# Altium project Pixracer_V1_FMU_Alternative.PrjPcb (part 2 of 2)
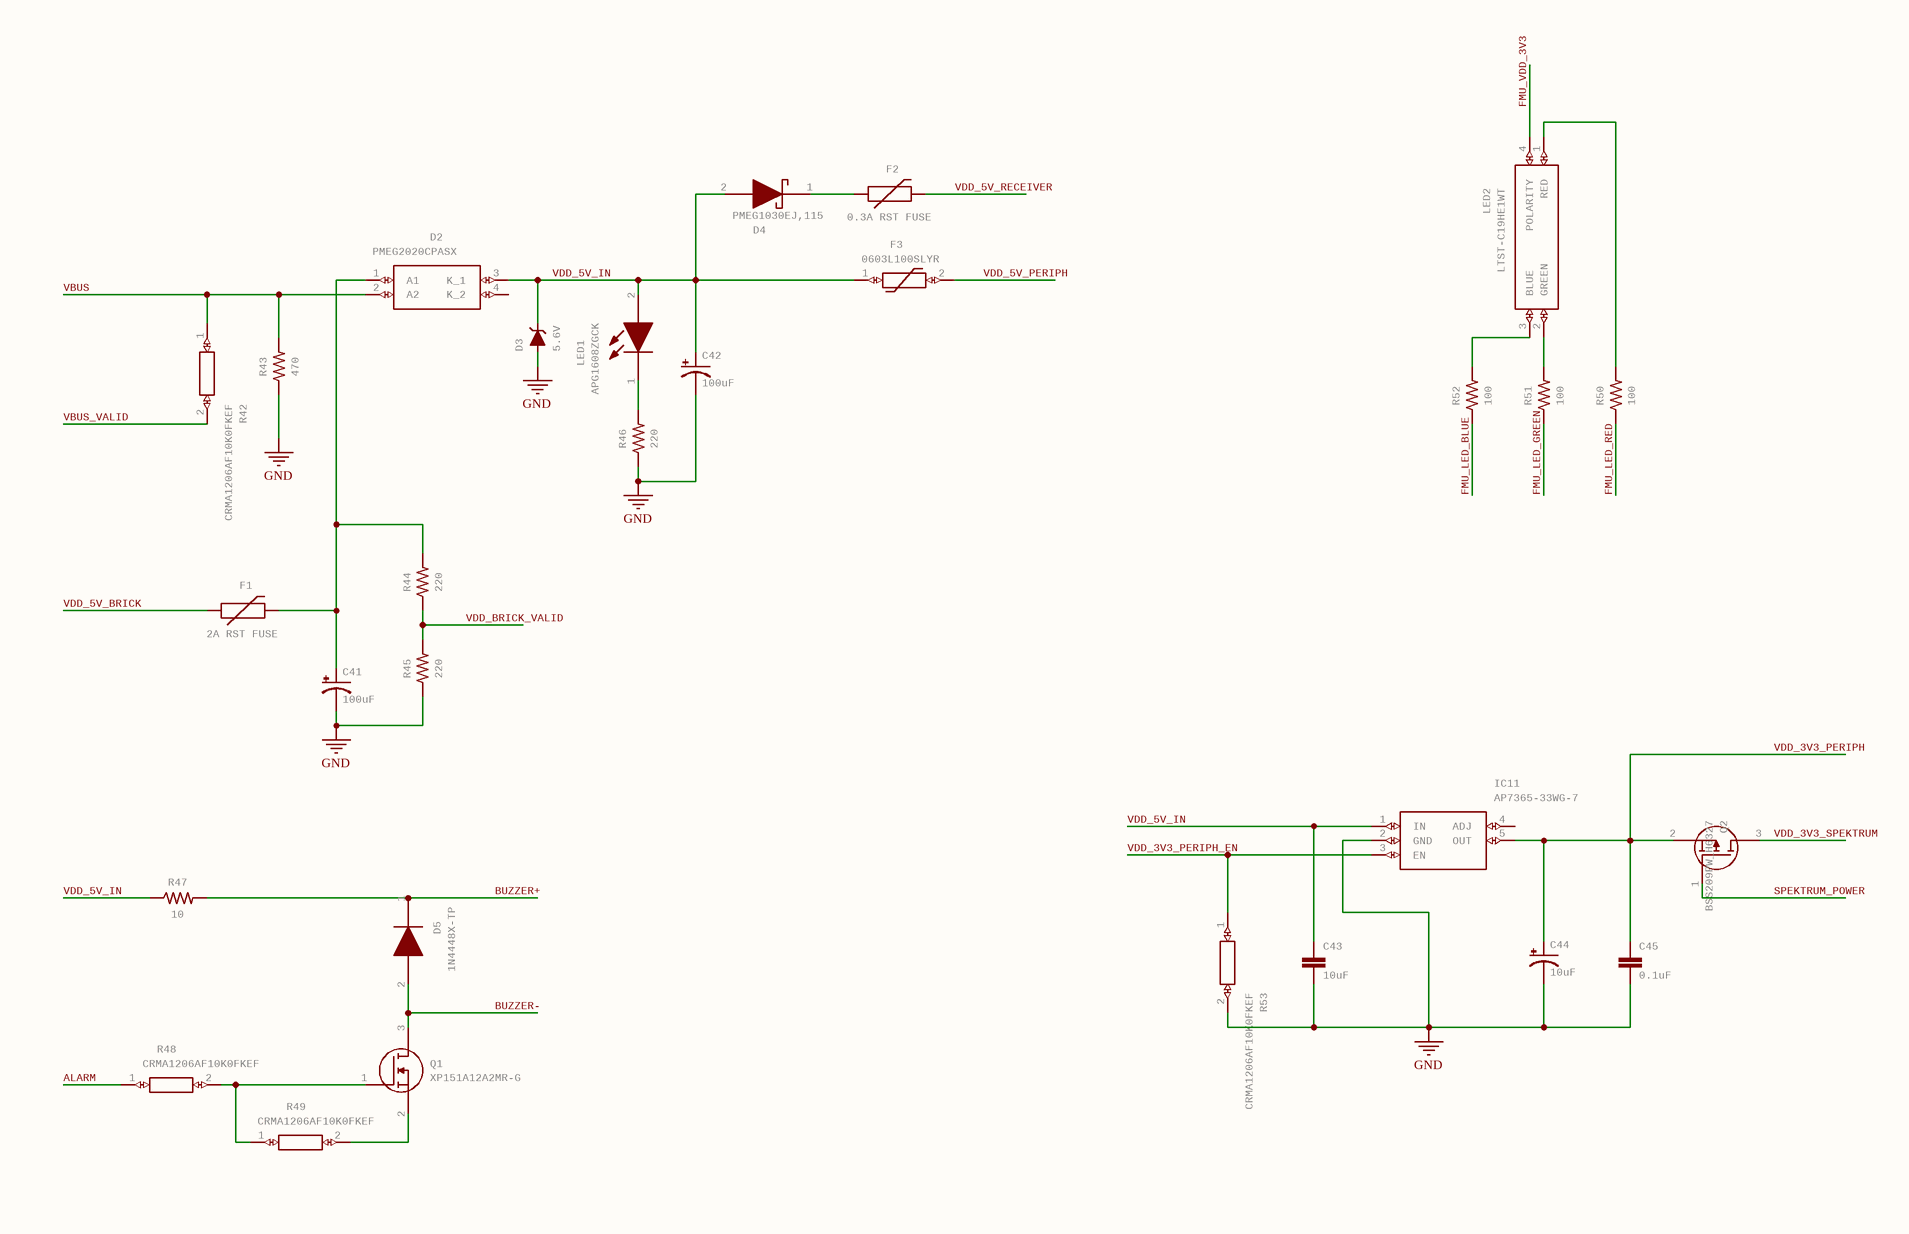
[diagram p6: Pixracer_V1_FMU_Alternative_4.SchDoc]

## Nets that join several sheets
GND: Pixracer_V1_FMU_Alternative_0 (30 pins), Pixracer_V1_FMU_Alternative_1 (32 pins), Pixracer_V1_FMU_Alternative_2 (19 pins), Pixracer_V1_FMU_Alternative_3 (20 pins), Pixracer_V1_FMU_Alternative_4 (11 pins)
8266_CTS: Pixracer_V1_FMU_Alternative_0 (IC1.41), Pixracer_V1_FMU_Alternative_3 (JP1.10)
8266_GPIO0: Pixracer_V1_FMU_Alternative_0 (IC1.1), Pixracer_V1_FMU_Alternative_3 (JP1.6)
8266_GPIO2: Pixracer_V1_FMU_Alternative_0 (IC1.90), Pixracer_V1_FMU_Alternative_3 (JP1.4)
8266_PD: Pixracer_V1_FMU_Alternative_0 (IC1.4), Pixracer_V1_FMU_Alternative_3 (JP1.3)
8266_RTS: Pixracer_V1_FMU_Alternative_0 (IC1.67), Pixracer_V1_FMU_Alternative_3 (JP1.5 JP1.9)
20608_CS: Pixracer_V1_FMU_Alternative_0 (IC1.9), Pixracer_V1_FMU_Alternative_1 (IC5.6)
20608_DRDY: Pixracer_V1_FMU_Alternative_0 (IC1.8), Pixracer_V1_FMU_Alternative_1 (IC5.5)
ALARM: Pixracer_V1_FMU_Alternative_0 (IC1.77), Pixracer_V1_FMU_Alternative_4 (R48.1)
BARO_CS: Pixracer_V1_FMU_Alternative_0 (IC1.88), Pixracer_V1_FMU_Alternative_1 (IC6.5)
BATT_CURRENT_SENS: Pixracer_V1_FMU_Alternative_0 (IC1.26), Pixracer_V1_FMU_Alternative_2 (C33.1 R8.1)
BUZZER+: Pixracer_V1_FMU_Alternative_3 (J13.5), Pixracer_V1_FMU_Alternative_4 (D5.1 R47.2)
BUZZER-: Pixracer_V1_FMU_Alternative_3 (J13.4), Pixracer_V1_FMU_Alternative_4 (D5.2 Q1.3)
CAN1_RX: Pixracer_V1_FMU_Alternative_0 (IC1.81), Pixracer_V1_FMU_Alternative_2 (IC8.4)
CAN1_TX: Pixracer_V1_FMU_Alternative_0 (IC1.82), Pixracer_V1_FMU_Alternative_2 (IC8.1)
FMU_CH1: Pixracer_V1_FMU_Alternative_0 (IC1.45), Pixracer_V1_FMU_Alternative_3 (R34.2)
FMU_CH2: Pixracer_V1_FMU_Alternative_0 (IC1.44), Pixracer_V1_FMU_Alternative_3 (R35.2)
FMU_CH3: Pixracer_V1_FMU_Alternative_0 (IC1.42), Pixracer_V1_FMU_Alternative_3 (R36.2)
FMU_CH4: Pixracer_V1_FMU_Alternative_0 (IC1.40), Pixracer_V1_FMU_Alternative_3 (R37.2)
FMU_CH5: Pixracer_V1_FMU_Alternative_0 (IC1.60), Pixracer_V1_FMU_Alternative_3 (R38.2)
FMU_CH6: Pixracer_V1_FMU_Alternative_0 (IC1.61), Pixracer_V1_FMU_Alternative_3 (R39.2)
FMU_I2C1_SCL: Pixracer_V1_FMU_Alternative_0 (IC1.95), Pixracer_V1_FMU_Alternative_3 (J9.4 R32.2)
FMU_I2C1_SDA: Pixracer_V1_FMU_Alternative_0 (IC1.96), Pixracer_V1_FMU_Alternative_3 (J9.5 R33.2)
FMU_LED_BLUE: Pixracer_V1_FMU_Alternative_0 (IC1.89), Pixracer_V1_FMU_Alternative_4 (R52.1)
FMU_LED_GREEN: Pixracer_V1_FMU_Alternative_0 (IC1.36), Pixracer_V1_FMU_Alternative_4 (R51.1)
FMU_LED_RED: Pixracer_V1_FMU_Alternative_0 (IC1.48), Pixracer_V1_FMU_Alternative_4 (R50.1)
FMU_RC_INPUT: Pixracer_V1_FMU_Alternative_0 (IC1.64), Pixracer_V1_FMU_Alternative_3 (IC9.4)
FMU_USART1_TX: Pixracer_V1_FMU_Alternative_0 (IC1.92), Pixracer_V1_FMU_Alternative_3 (JP1.8)
FMU_USART2_CTS: Pixracer_V1_FMU_Alternative_0 (IC1.84), Pixracer_V1_FMU_Alternative_3 (R30.1)
FMU_USART2_RTS: Pixracer_V1_FMU_Alternative_0 (IC1.85), Pixracer_V1_FMU_Alternative_3 (R31.1)
FMU_USART2_RX: Pixracer_V1_FMU_Alternative_0 (IC1.87), Pixracer_V1_FMU_Alternative_3 (R29.2)
FMU_USART2_TX: Pixracer_V1_FMU_Alternative_0 (IC1.86), Pixracer_V1_FMU_Alternative_3 (R28.2)
FMU_USART3_CTS: Pixracer_V1_FMU_Alternative_0 (IC1.58), Pixracer_V1_FMU_Alternative_3 (R26.1)
FMU_USART3_RTS: Pixracer_V1_FMU_Alternative_0 (IC1.59), Pixracer_V1_FMU_Alternative_3 (R27.1)
FMU_USART3_RX: Pixracer_V1_FMU_Alternative_0 (IC1.56), Pixracer_V1_FMU_Alternative_3 (R25.2)
FMU_USART3_TX: Pixracer_V1_FMU_Alternative_0 (IC1.55), Pixracer_V1_FMU_Alternative_3 (R24.2)
FMU_USART4_RX: Pixracer_V1_FMU_Alternative_0 (IC1.24), Pixracer_V1_FMU_Alternative_3 (J9.3)
FMU_USART4_TX: Pixracer_V1_FMU_Alternative_0 (IC1.23), Pixracer_V1_FMU_Alternative_3 (J9.2)
FMU_USART8_RX: Pixracer_V1_FMU_Alternative_0 (IC1.97), Pixracer_V1_FMU_Alternative_3 (IC10.3)
FMU_USART8_TX: Pixracer_V1_FMU_Alternative_0 (IC1.98), Pixracer_V1_FMU_Alternative_3 (IC10.2)
FMU_USART_RX: Pixracer_V1_FMU_Alternative_0 (IC1.93), Pixracer_V1_FMU_Alternative_3 (JP1.1)
FMU_VDD_3V3: Pixracer_V1_FMU_Alternative_0 (26 pins), Pixracer_V1_FMU_Alternative_2 (8 pins), Pixracer_V1_FMU_Alternative_3 (5 pins), Pixracer_V1_FMU_Alternative_4 (LED2.4)
FRAM_MISO: Pixracer_V1_FMU_Alternative_0 (IC1.53 IC3.2), Pixracer_V1_FMU_Alternative_1 (IC6.6)
FRAM_MOSI: Pixracer_V1_FMU_Alternative_0 (IC1.54 IC3.6), Pixracer_V1_FMU_Alternative_1 (IC6.7)
FRAM_SCK: Pixracer_V1_FMU_Alternative_0 (IC1.47 IC3.5), Pixracer_V1_FMU_Alternative_1 (IC6.8)
FRSKY_INV: Pixracer_V1_FMU_Alternative_0 (IC1.69), Pixracer_V1_FMU_Alternative_3 (IC10.1 IC10.5)
ICM20948_MISO: Pixracer_V1_FMU_Alternative_0 (IC1.31), Pixracer_V1_FMU_Alternative_1 (IC4.9 IC5.4)
ICM20948_MOSI: Pixracer_V1_FMU_Alternative_0 (IC1.32), Pixracer_V1_FMU_Alternative_1 (IC4.24 IC5.3)
ICM20948_SCK: Pixracer_V1_FMU_Alternative_0 (IC1.30), Pixracer_V1_FMU_Alternative_1 (IC4.23 IC5.2)
LED_SAFETY: Pixracer_V1_FMU_Alternative_0 (IC1.18), Pixracer_V1_FMU_Alternative_3 (R41.1)
OTG_FS_DM: Pixracer_V1_FMU_Alternative_0 (IC1.70), Pixracer_V1_FMU_Alternative_2 (R7.1)
RC_INPUT: Pixracer_V1_FMU_Alternative_0 (IC1.35), Pixracer_V1_FMU_Alternative_3 (IC9.1 R20.2)
RSSI_IN: Pixracer_V1_FMU_Alternative_0 (IC1.16), Pixracer_V1_FMU_Alternative_3 (R21.1)
SAFETY_SWITCH_IN: Pixracer_V1_FMU_Alternative_0 (IC1.33), Pixracer_V1_FMU_Alternative_3 (J13.1 R40.1)
SBUS_INV: Pixracer_V1_FMU_Alternative_0 (IC1.7), Pixracer_V1_FMU_Alternative_3 (IC9.2)
SDIO_CK: Pixracer_V1_FMU_Alternative_0 (IC1.80), Pixracer_V1_FMU_Alternative_2 (J4.5)
SDIO_CMD: Pixracer_V1_FMU_Alternative_0 (IC1.83), Pixracer_V1_FMU_Alternative_2 (J4.3 R17.2)
SDIO_D0: Pixracer_V1_FMU_Alternative_0 (IC1.65), Pixracer_V1_FMU_Alternative_2 (J4.7 R18.2)
SDIO_D1: Pixracer_V1_FMU_Alternative_0 (IC1.66), Pixracer_V1_FMU_Alternative_2 (J4.8 R14.1)
SDIO_D2: Pixracer_V1_FMU_Alternative_0 (IC1.78), Pixracer_V1_FMU_Alternative_2 (J4.1 R15.2)
SDIO_D3: Pixracer_V1_FMU_Alternative_0 (IC1.79), Pixracer_V1_FMU_Alternative_2 (J4.2 R16.2)
SPEKTRUM_POWER: Pixracer_V1_FMU_Alternative_0 (IC1.3), Pixracer_V1_FMU_Alternative_4 (Q2.1)
VBUS: Pixracer_V1_FMU_Alternative_0 (IC1.68), Pixracer_V1_FMU_Alternative_2 (C32.2 J2.1), Pixracer_V1_FMU_Alternative_4 (D2.2 R42.1 R43.2)
VBUS_VALID: Pixracer_V1_FMU_Alternative_0 (IC1.15), Pixracer_V1_FMU_Alternative_4 (R42.2)
VDD_3V3_PERIPH: Pixracer_V1_FMU_Alternative_3 (JP1.7), Pixracer_V1_FMU_Alternative_4 (C44.+ C45.1 IC11.5 Q2.2)
VDD_3V3_PERIPH_EN: Pixracer_V1_FMU_Alternative_0 (IC1.34), Pixracer_V1_FMU_Alternative_4 (IC11.3 R53.1)
VDD_3V3_SENSORS_EN: Pixracer_V1_FMU_Alternative_0 (IC1.2), Pixracer_V1_FMU_Alternative_1 (IC7.3 U1.3)
VDD_3V3_SPEKTRUM: Pixracer_V1_FMU_Alternative_3 (J6.4), Pixracer_V1_FMU_Alternative_4 (Q2.3)
VDD_5V_IN: Pixracer_V1_FMU_Alternative_0 (C14.1 U2.1 U2.3), Pixracer_V1_FMU_Alternative_1 (C26.1 C30.1 IC7.1), Pixracer_V1_FMU_Alternative_2 (R12.1), Pixracer_V1_FMU_Alternative_4 (9 pins)
VDD_5V_PERIPH: Pixracer_V1_FMU_Alternative_2 (C36.1 IC8.3 J5.1), Pixracer_V1_FMU_Alternative_3 (7 pins), Pixracer_V1_FMU_Alternative_4 (F3.2)
VDD_5V_RECEIVER: Pixracer_V1_FMU_Alternative_3 (J6.1), Pixracer_V1_FMU_Alternative_4 (F2.2)
VDD_5V_SENS: Pixracer_V1_FMU_Alternative_0 (IC1.29), Pixracer_V1_FMU_Alternative_2 (R12.2 R13.1)
VDD_BRICK_VALID: Pixracer_V1_FMU_Alternative_0 (IC1.91), Pixracer_V1_FMU_Alternative_4 (R44.1 R45.2)